# Altium schematic sheet Temp_Sensing.SchDoc: Temp Sensing Soldeerbout
size A4; DrawnBy: Robbe Th.; Revision: 1; SheetNumber: 3; SheetTotal: 5; Number: PXL_SEM2_SB03R1
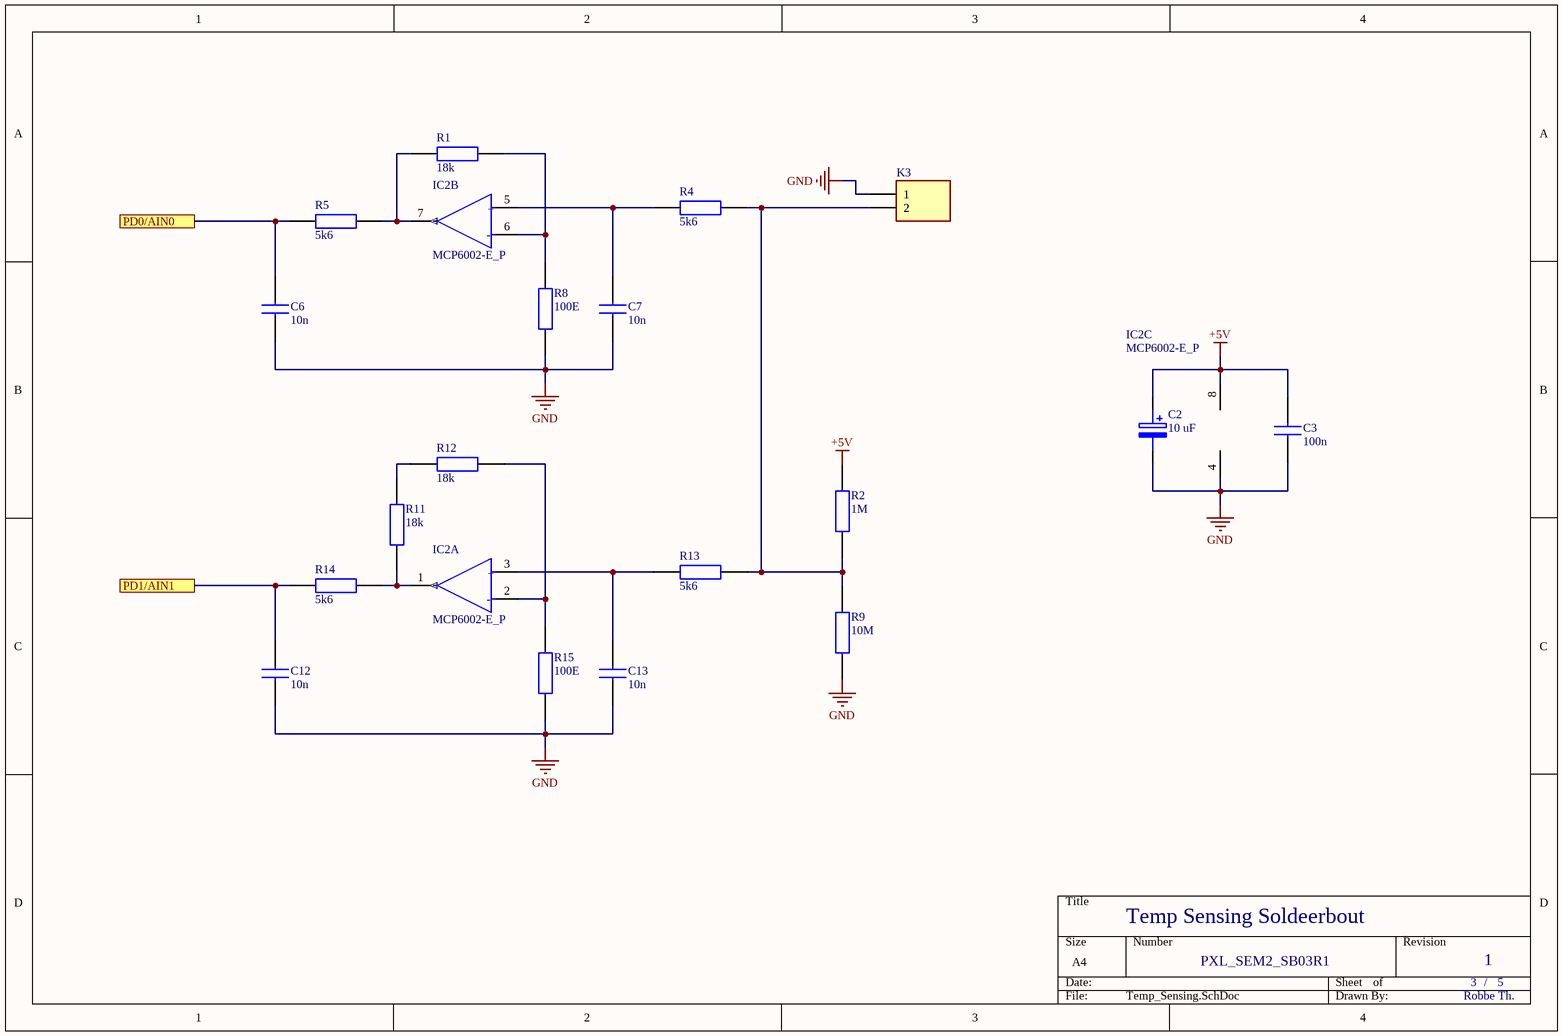
[diagram p0: Temp_Sensing.SchDoc]

## Parts
C2  10 uF  [CAPPRD200W52D500H1250]
C3  100n  [CAPC1005X56N]
C6  10n  [CAPC1005X56N]
C7  10n  [CAPC1005X56N]
C12  10n  [CAPC1005X56N]
C13  10n  [CAPC1005X56N]
IC2  MCP6002-E_P  [DIP781W56P254L950H533Q8N]  (parts A,B,C of 3)
K3  Printkroonsteen 2 POL  [1716020000]  (value not drawn)
R1  18k  [RESC2012X65N]
R2  1M  [RESC2012X65N]
R4  5k6  [RESC2012X65N]
R5  5k6  [RESC2012X65N]
R8  100E  [RESC2012X65N]
R9  10M  [RESC2012X65N]
R11  18k  [RESC2012X65N]
R12  18k  [RESC2012X65N]
R13  5k6  [RESC2012X65N]
R14  5k6  [RESC2012X65N]
R15  100E  [RESC2012X65N]

## Ports
PD0/AIN0, PD1/AIN1

## Nets
+5V: C2.1(+) C3.2 IC2.8(VDD) R2.2
GND: C2.2(-) C3.1 C6.1 C7.1 C12.1 C13.1 IC2.4(VSS) K3.1 R8.1 R9.1 R15.1
PD0/AIN0: C6.2 R5.1 ; port PD0/AIN0
PD1/AIN1: C12.2 R14.1 ; port PD1/AIN1
NetC7_2: C7.2 IC2.5(1IN+) R4.1
NetC13_2: C13.2 IC2.3(1IN+) R13.1
NetIC2_1: IC2.1(1OUT) R11.1 R14.2
NetIC2_2: IC2.2(1IN-) R12.2 R15.2
NetIC2_6: IC2.6(1IN-) R1.2 R8.2
NetIC2_7: IC2.7(OUT) R1.1 R5.2
NetK3_2: K3.2 R2.1 R4.2 R9.2 R13.2
NetR11_2: R11.2 R12.1

## Notes on the sheet
- /
- (in symbol MCP6002-E_P, part A) +; -
- (in symbol MCP6002-E_P, part B) +; -

## Library data of the parts
C2 = 860020672010: ELCO 10 uF; Manufacturer_Name: Wurth Elektronik; Datasheet Link: https://katalog.we-online.de/pbs/datasheet/860020672010.pdf; Height: 12.5mm; Manufacturer_Part_Number: 860020672010; Mouser Part Number: 710-860020672010; Mouser Price/Stock: https://www.mouser.co.uk/ProductDetail/Wurth-Elektronik/860020672010?qs=0KOYDY2FL2%252BaHkqkc1q4lw%3D%3D
C3 C6 C7 C12 C13 = 0402YC104MAT2A: Capacitor SMD 0805; Manufacturer_Name: AVX; Datasheet Link: http://www.mouser.com/catalog/supplier/library/pdf/AVXSurfaceMountCeramic.pdf; Height: 0.56mm; Manufacturer_Part_Number: 0402YC104MAT2A; Mouser Part Number: 581-0402YC104MAT2A; Mouser Price/Stock: https://www.mouser.co.uk/ProductDetail/AVX/0402YC104MAT2A?qs=O2%2FeDh0sX9yiCaLwpXy1bw%3D%3D
IC2 = MCP6002-E_P: Dual OPAMP; Manufacturer_Name: Microchip; Manufacturer_Part_Number: MCP6002-E/P; Datasheet Link: http://componentsearchengine.com/Datasheets/3/MCP6002-E_P.pdf; Height: 5.334mm; Mouser Part Number: 579-MCP6002-E/P; Mouser Price/Stock: https://www.mouser.co.uk/ProductDetail/Microchip-Technology/MCP6002-E-P?qs=hul3WK2zl4pqRWzdnAsu%2FQ%3D%3D; Arrow Part Number: MCP6002-E/P; Arrow Price/Stock: https://www.arrow.com/en/products/mcp6002-ep/microchip-technology?region=nac
K3 = 1716020000: Manufacturer_Name: Weidmuller; Datasheet Link: https://catalog.weidmueller.com/catalog/Start.do?ObjectID=1716020000&_ga=2.21797499.1716783809.1613378202-511725545.1613378202; Manufacturer_Part_Number: 1716020000; Mouser Part Number: 470-1716020000; Mouser Price/Stock: https://www.mouser.co.uk/ProductDetail/Weidmuller/1716020000?qs=WJDKaGZ8K%252B7GSEFQgvMjVA%3D%3D
R1 R2 R4 R5 R8 R9 R11-R15 = CPF0805B100RE1: Resistor SMD 0805; Manufacturer_Name: TE Connectivity; Datasheet Link: https://datasheet.datasheetarchive.com/originals/distributors/DKDS-21/401696.pdf; Height: 0.65mm; Manufacturer_Part_Number: CPF0805B100RE1; Mouser Part Number: 279-CPF0805B100RE1; Mouser Price/Stock: https://www.mouser.co.uk/ProductDetail/TE-Connectivity-Holsworthy/CPF0805B100RE1?qs=9ylKvqdyudkCWLPT1QvLZQ%3D%3D; Arrow Part Number: CPF0805B100RE1; Arrow Price/Stock: https://www.arrow.com/en/products/cpf0805b100re1/te-connectivity?region=nac